# EAGLE design CurrentSensorV2.0 (EAGLE 6.5.0)
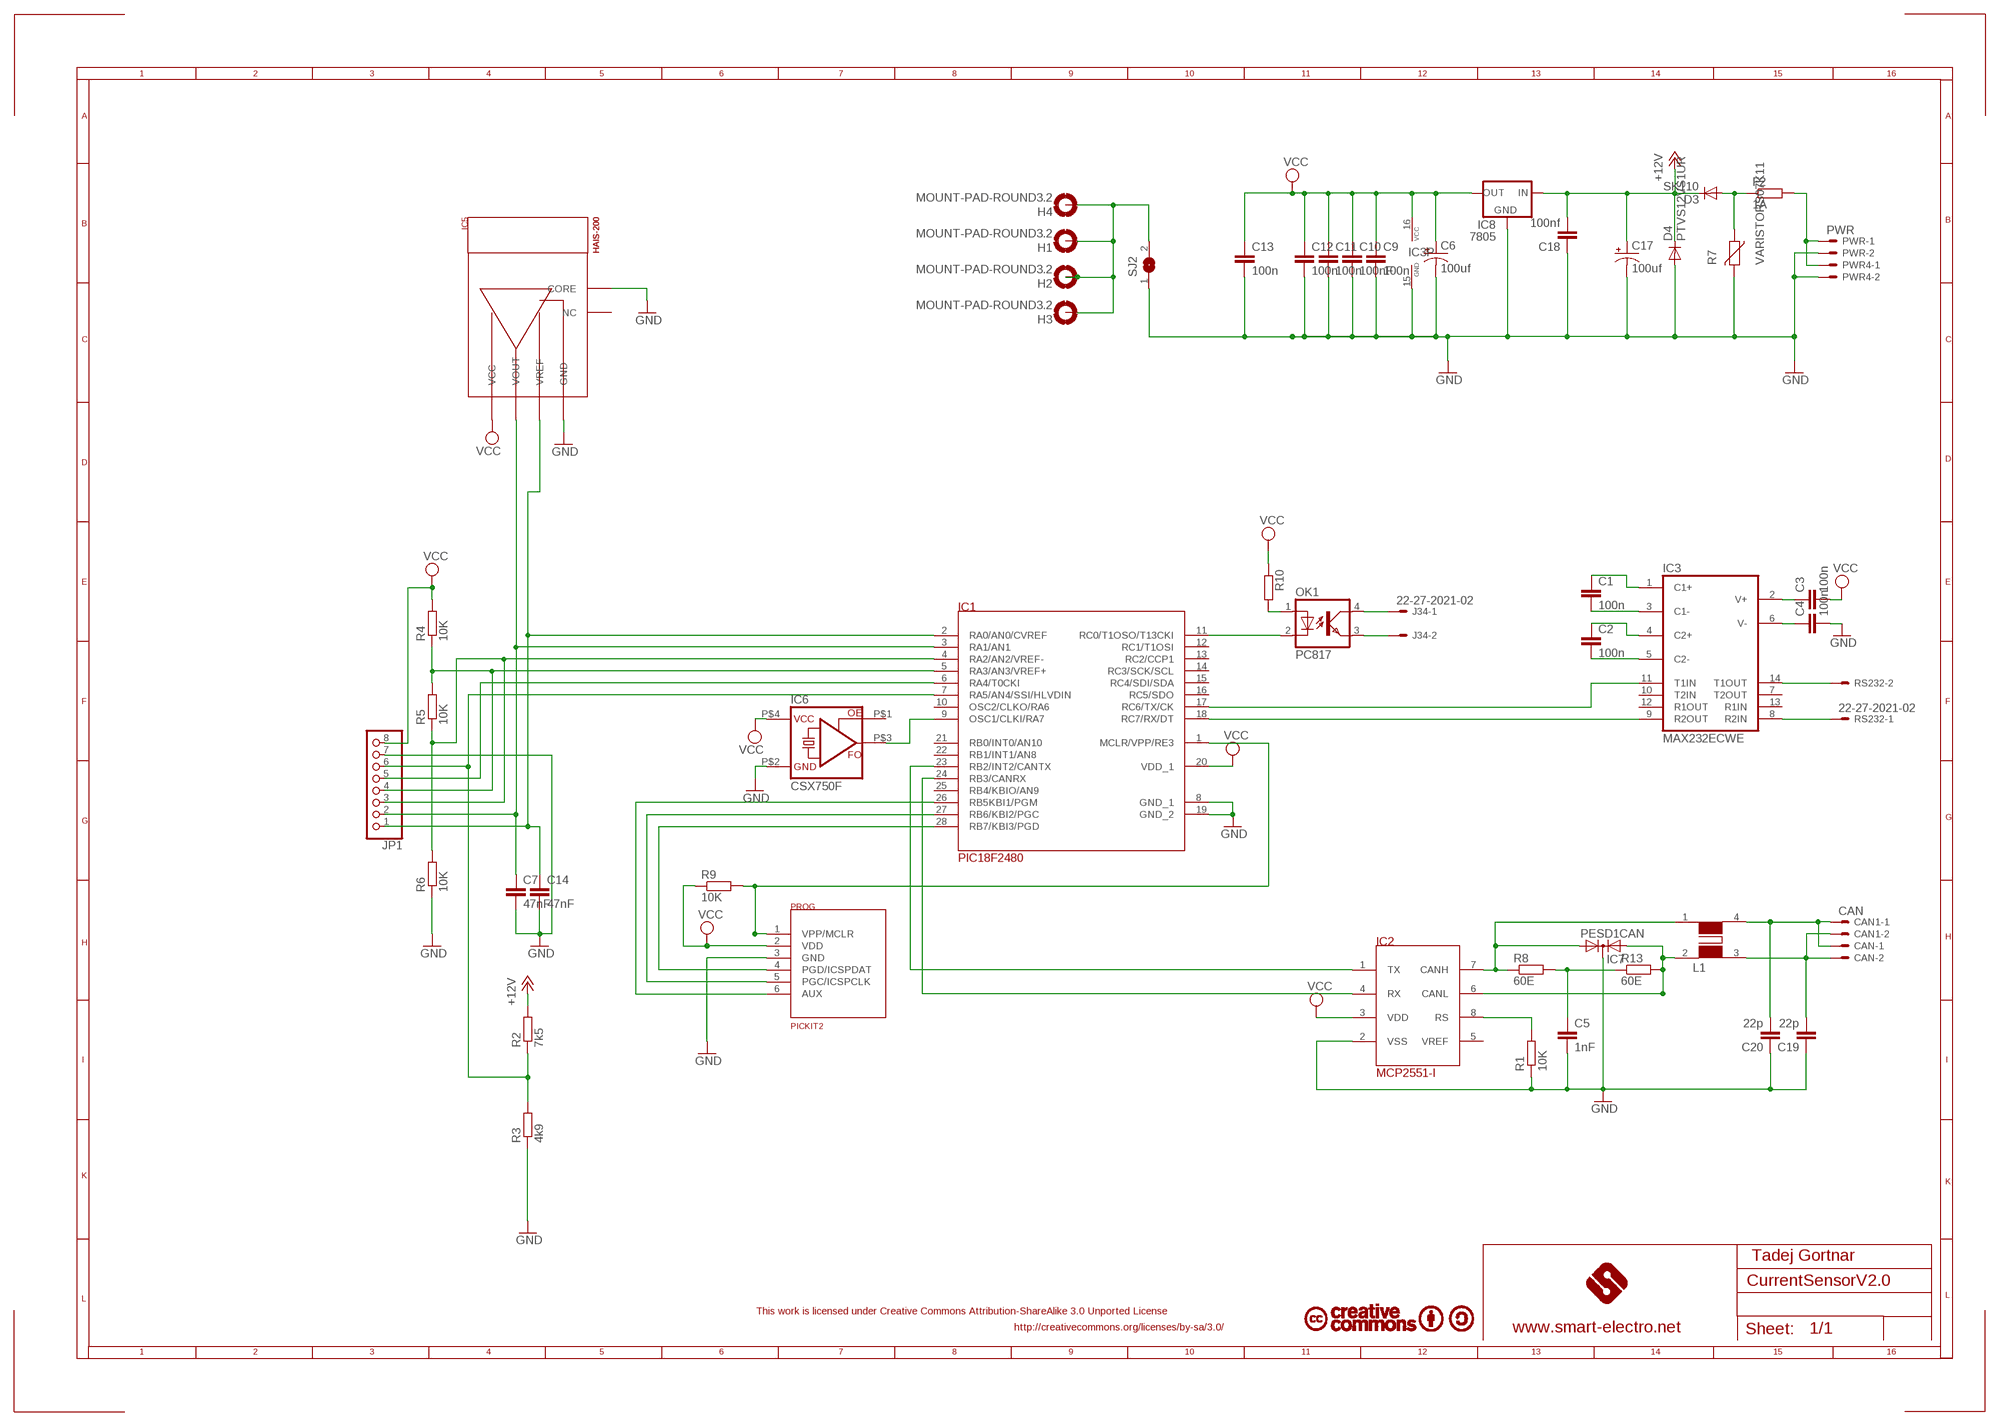
[diagram p0: schematic, sheet 1]

## Parts
C1  100n  C-EUC0805K  [C0805K]
C2  100n  C-EUC0805K  [C0805K]
C3  100n  C-EUC0805K  [C0805K]
C4  100n  C-EUC0805K  [C0805K]
C5  1nF  C-EUC0805  [C0805]
C6  100uf  CPOL-USC  [PANASONIC_C]
C7  47nF  C-EUC0805K  [C0805K]
C9  100n  C-EUC0805K  [C0805K]
C10  100nF  C-EUC0805K  [C0805K]
C11  100n  C-EUC0805K  [C0805K]
C12  100n  C-EUC0805K  [C0805K]
C13  100n  C-EUC0805K  [C0805K]
C14  47nF  C-EUC0805K  [C0805K]
C17  100uf  CPOL-USC  [PANASONIC_C]
C18  100nf  C-EUC0805  [C0805]
C19  22p  C-EUC0805  [C0805]
C20  22p  C-EUC0805  [C0805]
CAN  CAN  22-27-2021-02  [6410-02]
CAN1  CAN  22-27-2021-02  [6410-02]
D3  SK110  DIODE-MINIMELF  [MINIMELF]
D4  PTVS12VS1UR  DIODE-SOD323-W  [SOD323-W]
F2  1A  R-EU_R1206  [R1206]
H1  MOUNT-PAD-ROUND3.2  [3,2-PAD]
H2  MOUNT-PAD-ROUND3.2  [3,2-PAD]
H3  MOUNT-PAD-ROUND3.2  [3,2-PAD]
H4  MOUNT-PAD-ROUND3.2  [3,2-PAD]
IC1  PIC18F2480  PIC18F280  [SO-28W]
IC2  MCP2551-I  MCP2551  [SO-08]
IC3  MAX232ECWE  [SO16L]
IC5  HAIS-200  [HAIS-P]
IC6  CSX750F  [CSX750]
IC7  PESD1CAN  BAS70-06  [SOT23]
IC8  7805  78XXS'SOT223'  [SOT223]
J34  22-27-2021-02  [6410-02]
JP1  PINHD-1X8  [1X08]
L1  WE-DD_M/S  [WE-DD_M/S]
OK1  PC817  [DIL04]
PROG  PICKIT2  [PINHD-1X6]
PWR  PWR  22-27-2021-02  [6410-02]
PWR4  PWR  22-27-2021-02  [6410-02]
R1  10K  R-EU_M0805  [M0805]
R2  7k5  R-EU_M0805  [M0805]
R3  4k9  R-EU_M0805  [M0805]
R4  10K  R-EU_M0805  [M0805]
R5  10K  R-EU_M0805  [M0805]
R6  10K  R-EU_M0805  [M0805]
R7  VARISTORS07K11  [S07K11]
R8  60E  R-EU_R0805  [R0805]
R9  10K  R-EU_M0805  [M0805]
R10  R-EU_M0805  [M0805]
R13  60E  R-EU_R0805  [R0805]
RS232  22-27-2021-02  [6410-02]
SJ2  SJ  [SJ]

## Nets
+12V: C17.+ C18.2 D3.C D4.C IC8.1(IN) R2.2
AGND: H1.B3,2(MOUNT) H2.B3,2(MOUNT) H3.B3,2(MOUNT) H4.B3,2(MOUNT) SJ2.2
GND: C4.2 C5.2 C6.- C7.2 C9.2 C10.2 C11.2 C12.2 C13.2 C14.2 C17.- C18.1 C19.1 C20.1 D4.A IC1.8(GND_1) IC1.19(GND_2) IC2.2(VSS) IC3.15(GND) IC5.P$2(GND) IC5.P$5(CORE) IC6.P$2(GND) IC7.3(C) IC8.2(GND) JP1.7 PROG.3(GND) PWR4.2 PWR.2 R1.1 R3.1 R6.1 R7.2 SJ2.1
N$1: IC1.1(MCLR/VPP/RE3) PROG.1(VPP/MCLR) R9.2
N$2: IC1.24(RB3/CANRX) IC2.4(RX)
N$3: IC2.7(CANH) IC7.1(A1) L1.1 R8.1
N$4: IC1.23(RB2/INT2/CANTX) IC2.1(TX)
N$5: C7.1 IC1.3(RA1/AN1) IC5.P$3(VOUT) JP1.2
N$6: C14.1 IC1.2(RA0/AN0/CVREF) IC5.P$4(VREF) JP1.1
N$8: IC1.9(OSC1/CLKI/RA7) IC6.P$3(FO)
N$9: IC1.28(RB7/KBI3/PGD) PROG.4(PGD/ICSPDAT)
N$10: IC1.27(RB6/KBI2/PGC) PROG.5(PGC/ICSPCLK)
N$11: IC1.26(RB5KBI1/PGM) PROG.6(AUX)
N$14: IC1.17(RC6/TX/CK) IC3.11(T1IN)
N$15: IC1.18(RC7/RX/DT) IC3.9(R2OUT)
N$16: IC3.8(R2IN) RS232.1
N$17: IC3.14(T1OUT) RS232.2
N$18: C3.1 IC3.2(V+)
N$19: C4.1 IC3.6(V-)
N$21: C1.1 IC3.1(C1+)
N$22: C1.2 IC3.3(C1-)
N$24: IC1.11(RC0/T1OSO/T13CKI) OK1.2(C)
N$25: C5.1 R8.2 R13.1
N$26: C2.1 IC3.4(C2+)
N$27: C2.2 IC3.5(C2-)
N$28: IC1.4(RA2/AN2/VREF-) JP1.3 R5.1 R6.2
N$29: IC1.5(RA3/AN3/VREF+) JP1.4 R4.1 R5.2
N$30: IC1.6(RA4/T0CKI) JP1.5
N$31: IC1.7(RA5/AN4/SSI/HLVDIN) JP1.6 R2.1 R3.2
N$32: OK1.1(A) R10.2
N$33: J34.2 OK1.3(EMIT)
N$34: J34.1 OK1.4(COL)
N$73: IC2.8(RS) R1.2
N$82: IC2.6(CANL) IC7.2(A2) L1.2 R13.2
N$85: F2.2 PWR4.1 PWR.1
N$86: D3.A F2.1 R7.1
N$88: C20.2 CAN1.1 CAN.1 L1.4
N$89: C19.2 CAN1.2 CAN.2 L1.3
VCC: C3.2 C6.+ C9.1 C10.1 C11.1 C12.1 C13.1 IC1.20(VDD_1) IC2.3(VDD) IC3.16(VCC) IC5.P$1(VCC) IC6.P$4(VCC) IC8.3(OUT) JP1.8 PROG.2(VDD) R4.2 R9.1 R10.1
Unconnected: IC1.10(OSC2/CLKO/RA6) IC1.12(RC1/T1OSI) IC1.13(RC2/CCP1) IC1.14(RC3/SCK/SCL) IC1.15(RC4/SDI/SDA) IC1.16(RC5/SDO) IC1.21(RB0/INT0/AN10) IC1.22(RB1/INT1/AN8) IC1.25(RB4/KBIO/AN9) IC2.5(VREF) IC3.7(T2OUT) IC3.10(T2IN) IC3.12(R1OUT) IC3.13(R1IN) IC5.P$6(NC) IC6.P$1(OE)

## Notes on the sheet
- Tadej Gortnar
- This work is licensed under Creative Commons Attribution-ShareAlike 3.0 Unported License
- http://creativecommons.org/licenses/by-sa/3.0/ | www.smart-electro.net

## Library data of the parts
C1-C5 C7 C9-C14 C19 C20 = rcl:C-EU: CAPACITOR, European symbol
C6 C17 = resistor:CPOL-US: POLARIZED CAPACITOR, American symbol
C18 = resistor:C-EU: CAPACITOR, European symbol
CAN CAN1 J34 PWR PWR4 RS232 = con-molex:22-?-02: CONNECTOR wire to board 2.54 mm (.1 inch) pitch header; OC_FARNELL: unknown; OC_NEWARK: unknown
D3 D4 = diode:DIODE-: DIODE
F2 = resistor:R-EU_: RESISTOR, European symbol
H1-H4 = holes:MOUNT-PAD-ROUND: MOUNTING PAD, round
IC1 = microchip-5:PIC18F2*80: PIC18F2480 Enhenced Flash Microcontroler with ECAN
IC2 = microchip-5:MCP2551: High Speed CAN Transceiver
IC3 = maxim:MAX232ECWE: RS232 TRANSEIVER
IC5 = lem:HAIS-200: Current Transducer
IC6 = crystal:CSX750F: CRYSTAL RESONATOR
IC7 = diode:BAS70-06: Silicon Schottky Diodes General-purpose diode for high-speed switching
IC8 = v-reg:78XXS: VOLTAGE REGULATOR
JP1 = pinhead_old:PINHD-1X8
L1 = wuerth-elektronik:WE-DD: SMD-Shielded Power Transformers (SEPIC) WE_DD WE-DD with two identical windings is perfect for SEPIC- switching regulators - 1:1 transformer - Double inductor with two identical windings -- SEPIC-switching regulators
OK1 = optocoupler:PC817: SHARP OPTO COUPLER
PROG = microchip-5:PICKIT2: PIC Kit 2 - Programer
R1-R6 R8-R10 R13 = rcl:R-EU_: RESISTOR, European symbol
R7 = varistor:VARISTOR: VARISTOR
SJ2 = jumper:SJ: SMD solder JUMPER

## Net classes
1 balancing current: width 1.524 mm

## Board
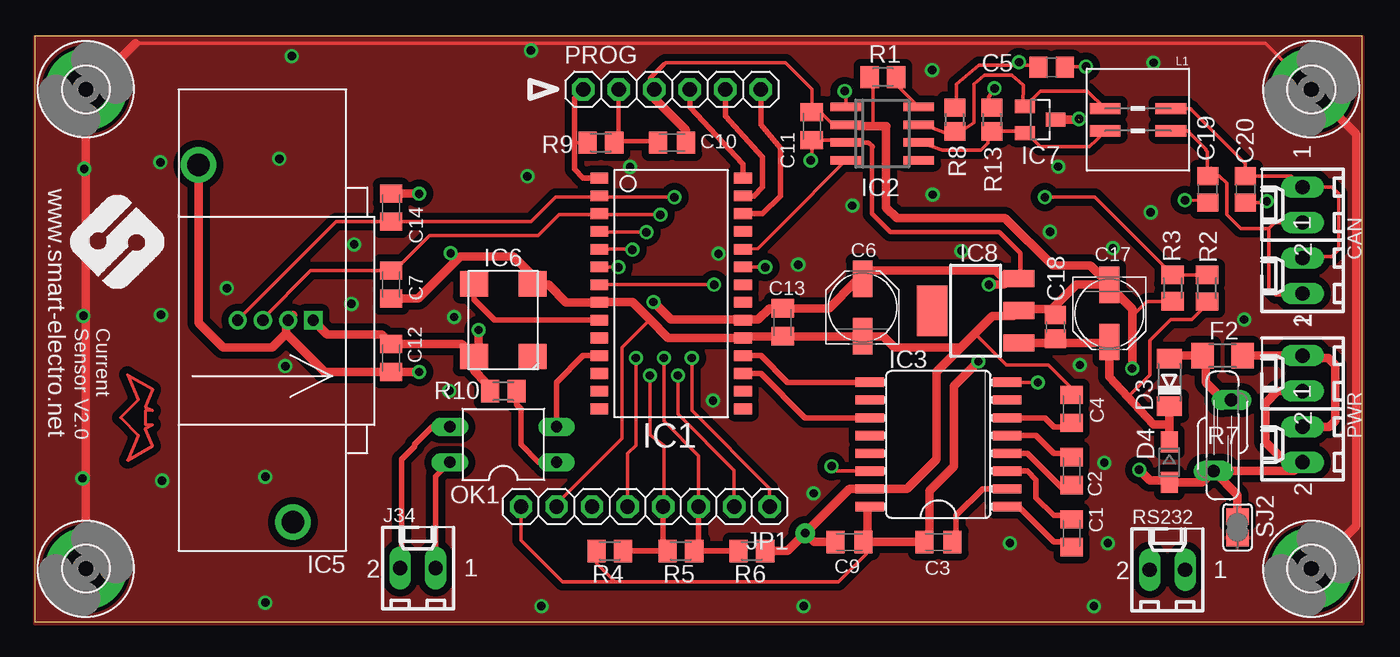
[diagram p1: board, top side]
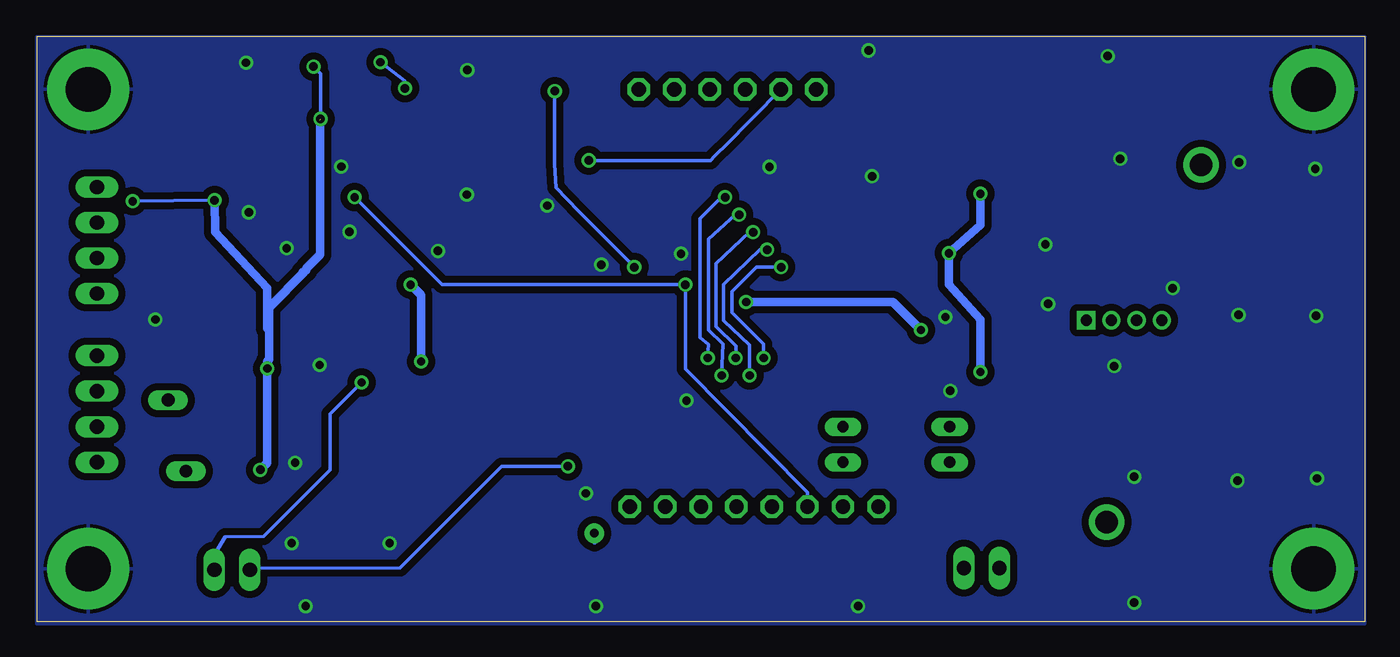
[diagram p2: board, bottom side, seen from below]

Size 94.92 x 41.9 mm. Coordinates in mm from the lower left corner, seen from the top.
Outline: 0,0 94.92,0 94.92,41.9 0,41.9 0,0
Copper layers (1*16): Top 0.035mm / dielectric 1.5mm / Bottom 0.035mm
Design rules "default2 *": minimum track width 10mil, minimum drill 0.6mm, track to track 8mil, track to pad 8mil, pad to pad 8mil, via to via 8mil, smd to smd 8mil, copper to edge 0mil, drill to drill 8mil, minimum pad ring 10mil, minimum via ring 8mil, stop-mask expansion 4mil, vias tented up to drill 0mil, thermal gap 10mil

### Footprints (pad centres in the part's own frame; a part is rotated, then mirrored left to right if it is on the bottom)
C0805K = smd 1.3 x 1.6: 1 -1,0; 2 1,0
C0805 = smd 1.3 x 1.5: 1 -0.95,0; 2 0.95,0
PANASONIC_C = smd 2.6 x 1.4: + 2.05,0; - -2.05,0
C0805' = smd 1.3 x 1.5: 1 -0.85,0; 2 0.85,0
6410-02 = drill 1.016 long: 1 1.27,0; 2 -1.27,0
MINIMELF = smd 1.4 x 1.8: A 1.7,0; C -1.7,0
SOD323-W = smd 1.5 x 1.2: A 1.45,0; C -1.45,0
R1206 = smd 1.6 x 1.803: 1 -1.422,0; 2 1.422,0
3,2-PAD = drill 3.2 pad 5.842: B3,2 0,0
SO-28W = smd 0.762 x 1.27: 1 -7.62,-5.207; 2 -6.35,-5.207; 3 -5.08,-5.207; 4 -3.81,-5.207; 5 -2.54,-5.207; 6 -1.27,-5.207; 7 0,-5.207; 8 1.27,-5.207; 9 2.54,-5.207; 10 3.81,-5.207; 11 5.08,-5.207; 12 6.35,-5.207; 13 7.62,-5.207; 14 8.89,-5.207; 15 8.89,5.08; 16 7.62,5.08; 17 6.35,5.08; 18 5.08,5.08; 19 3.81,5.08; 20 2.54,5.08; 21 1.27,5.08; 22 0,5.08; 23 -1.27,5.08; 24 -2.54,5.08; 25 -3.81,5.08; 26 -5.08,5.08; 27 -6.35,5.08; 28 -7.62,5.08
SO-08 = smd 0.6 x 2.2: 1 -1.905,-2.6; 2 -0.635,-2.6; 3 0.635,-2.6; 4 1.905,-2.6; 5 1.905,2.6; 6 0.635,2.6; 7 -0.635,2.6; 8 -1.905,2.6
SO16L = smd 0.66 x 2.032: 1 -4.445,-4.902; 2 -3.175,-4.902; 3 -1.905,-4.902; 4 -0.635,-4.902; 5 0.635,-4.902; 6 1.905,-4.902; 7 3.175,-4.902; 8 4.445,-4.902; 9 4.445,4.902; 10 3.175,4.902; 11 1.905,4.902; 12 0.635,4.902; 13 -0.635,4.902; 14 -1.905,4.902; 15 -3.175,4.902; 16 -4.445,4.902
HAIS-P = drill 0.8 square: P$1 0,8.636 | drill 0.8: P$2 0,6.836; P$3 0,5.036; P$4 0,3.236 | drill 1.6 pad 2.54: P$5 -11.098,0.436; P$6 14.456,7.19
CSX750 = smd 1.8 x 2: P$1 -2.6,-2.1; P$2 2.6,-2.1; P$3 2.6,2.1; P$4 -2.6,2.1
SOT23 = smd 1 x 1.4: 1 -0.95,-1.1; 2 0.95,-1.1; 3 0,1.1
SOT223 = smd 1.219 x 2.235: 1 -2.311,-3.099; 2 0,-3.099; 3 2.311,-3.099 | smd 3.6 x 2.2: 4 0,3.099
1X08 = drill 1.016 pad 1.6 octagon: 1 -8.89,0; 2 -6.35,0; 3 -3.81,0; 4 -1.27,0; 5 1.27,0; 6 3.81,0; 7 6.35,0; 8 8.89,0
WE-DD_M/S = smd 0.8 x 2.2: 1 -0.8,-2.35; 2 0.8,-2.35; 3 0.8,2.35; 4 -0.8,2.35
DIL04 = drill 0.813 long: 1 -1.27,-3.81; 2 1.27,-3.81; 3 1.27,3.81; 4 -1.27,3.81
PINHD-1X6 = drill 1.016 pad 1.6 octagon: 1 -6.35,0; 2 -3.81,0; 3 -1.27,0; 4 1.27,0; 5 3.81,0; 6 6.35,0
M0805 = smd 1.3 x 1.6: 1 -0.95,0; 2 0.95,0
S07K11 = drill 0.914 long: 1 -0.635,-2.54; 2 0.635,2.54
R0805 = smd 1.3 x 1.5: 1 -0.85,0; 2 0.85,0
SJ = smd 1.168 x 1.6: 1 -0.762,0; 2 0.762,0

### Placement (x,y rotation side)
C1  74.13,6.34 90 top
C2  74.13,10.79 90 top
C3  64.61,5.71 180 top
C4  74.13,15.24 90 top
C5  72.7,39.68 0 top
C6  59.18,22.49 90 top
C7  25.47,24.13 270 top
C9  58.25,5.71 180 top
C10  45.55,34.29 0 top
C11  55.56,35.47 90 top
C12  25.47,18.88 270 top
C13  53.46,21.43 270 top
C14  25.47,29.63 90 top
C17  76.83,22.07 270 top
C18  100nf  [C0805']  72.97,21.1 270 top
C19  83.86,30.95 90 top
C20  86.56,30.95 90 top
CAN  90.64,29.84 90 top
CAN1  90.64,24.76 90 top
D3  81.11,17.14 90 top
D4  81.11,11.43 270 top
F2  84.92,19.04 0 top
H1  3.64,3.8 0 top
H2  91.28,3.8 0 top
H3  91.28,38.1 0 top
H4  3.64,38.1 0 top
IC1  45.55,24.12 270 top
IC2  60.6,34.93 270 top
IC3  64.61,12.7 90 top
IC5  11.27,21.58 270 top
IC6  33.49,21.58 90 top
IC7  71.89,35.93 270 top
IC8  67.27,22.26 90 top
J34  27.39,3.84 0 top
JP1  43.65,8.25 180 top
L1  78.88,35.93 270 top
OK1  33.49,12.7 90 top
PROG  45.55,38.1 0 top
PWR  90.64,12.7 90 top
PWR4  90.64,17.77 90 top
R1  60.64,38.97 0 top
R2  83.81,23.88 270 top
R3  81.34,23.88 90 top
R4  41.11,5.08 180 top
R5  46.19,5.08 180 top
R6  51.27,5.08 180 top
R7  84.92,13.33 180 top
R8  65.78,35.94 90 top
R9  40.48,34.29 180 top
R10  33.49,16.5 0 top
R13  68.43,35.94 270 top
RS232  80.98,3.73 0 top
SJ2  86,6.77 270 top

### Tracks (layer width: path | path; a pad name or v marks a point on that pad's centre or on a via)
+12V
  Top 0.254: R2.2 83.81,22.72 82.72,21.63 81.22,21.63 79.72,20.13 79.72,17.65 78.16,16.09
  Top 0.61: D3.C 81.11,14.13 | 81.11,14.13 D4.C | IC8.1 72.97,19.95 | 72.97,19.95 75.76,19.95 C17.+ 76.83,17.52 78.16,16.09 79.97,14.13 81.11,14.13 | C18.2 72.97,19.95
AGND  (via drill 0.6)
  Top 0.254: 7.22,41.38 87.99,41.38 H3.B3,2
  Top 0.61: H2.B3,2 91.39,3.8 94.47,6.88 94.47,34.9 H3.B3,2 | H1.B3,2 H4.B3,2 3.93,38.1 7.22,41.38
  other vias: 35.47,40.88 13.72,23.88 64.16,39.48 64.2,30.57 73.17,32.57 79.79,29.3 86.47,21.63 74.72,18.38 76.47,11.38 76.72,5.63 69.72,5.63 75.72,1.13 54.97,1.13 36.22,1.13 16.47,1.38 16.47,10.38 17.47,33.13 18.37,40.47 8.97,32.88 9.09,10.11 3.4,10.26 3.46,21.89 3.52,32.41 9.01,21.97 35.22,31.88 79.99,40.01 17.9,18.29 29.62,16.54 22.82,27.01 22.63,22.75 29.97,21.81 42.55,32.55 48.88,26.34 55.68,9.19 48.49,15.83 54.58,25.56 66.26,26.54 58.45,29.78 72.59,27.9 77.08,26.73
  pour Top (isolate 0.5): 0.22,41.88 94.97,41.88 94.97,-0.12 -0.03,-0.12 -0.03,41.88
  pour Bottom (isolate 0.5): 0.22,41.88 94.97,41.88 94.97,-0.12 -0.03,-0.12 -0.03,41.88
GND  (via drill 0.6, 0.6 pad 1.42)  (1 unrouted)
  Top 0.254: v75.16,39.73 73.7,39.73 C5.2 | C20.1 87.6,30 87.72,29.88 v88.09,30.09 | v82.24,30.17 83.72,30.13 C19.1 | 50.75,20.43 IC1.19 | 56.91,35.73 56.17,36.47 C11.2 55.56,38.13 53.68,40.01 45.1,40.01 44.99,39.9 | 56.91,35.73 57.83,35.73 IC2.2 59.49,35.56 | 59.49,35.56 59.91,35.48 59.91,38.4 R1.1 | R3.1 79.53,22.93 78.47,21.88 | 56.91,35.73 57.16,35.48 58.91,35.48 59.41,35.48 59.49,35.56 | JP1.7 37.3,8.46 41.97,13.13 41.97,19.63 43.97,21.63 | C4.2 74.13,16.72 72.47,18.38 69.47,18.38 67.22,20.63
  Top 0.305: 46.55,35.19 46.55,35.3 43.97,37.88 43.97,38.88 44.99,39.9 | 59.85,39.01 R1.1
  Top 0.61: C10.2 46.55,35.19 44.28,37.46 PROG.3 | R6.1 53.81,5.08 v55.08,6.34 | v55.08,6.34 58.25,9.52 IC3.15 62.36,9.52 64.47,11.63 64.47,17.88 66.22,19.63 | v55.08,6.34 55.71,5.71 C9.2 | C6.- C13.2 50.75,20.43 | C6.- | C6.- 60.67,20.43 61.47,19.63 66.22,19.63 | 66.22,19.63 67.22,20.63 68.47,21.88 69.98,21.88 IC8.2 70.48,22.38 72.72,22.38 | R7.2 83.47,9.98 D4.A 80.96,10.13 79.72,10.13 v78.97,10.88 78.87,10.78 | R7.2 90,10.79 PWR.2 90.44,11.63 89.22,11.63 87.97,12.88 87.97,15.63 88.84,16.5 PWR4.2 | C17.- 74.46,24.12 72.72,22.38 | C17.- 76.73,24.12 78.47,22.38 78.47,21.88 v78.47,18.13 | C18.1 72.97,22.13 72.72,22.38 | IC1.19 45.28,20.31 43.97,21.63 42.72,22.88 40.37,22.88 IC1.8 37.99,22.86 36.72,24.13 35.64,24.13 IC6.P$2 35.59,24.76 34.22,26.13 30.41,26.13 30.19,25.91 | 18.47,21.95 IC5.P$2 17.97,21.45 17.97,20.63 | 58.91,35.48 59.91,35.48 60.91,35.48 60.87,35.44 60.87,29.65 61.64,28.88 69.38,28.88 72.78,25.47 75.47,25.47 C17.- | IC5.P$5 11.7,21.4 13.47,19.63 16.97,19.63 17.97,20.63 | 17.97,20.63 20.72,17.88 C12.2 v27.47,17.88 | C7.2 27.41,23.13 30.19,25.91 | C14.2 v27.47,30.63 | v29.72,26.38 30.19,25.91 | SJ2.1 86,9.08 R7.2 | IC7.3 74.6,35.93 v74.66,35.98
  Bottom 0.254: v75.16,39.73 74.66,39.23 v74.66,35.98 | v88.09,30.09 v82.24,30.17
  Bottom 0.406: v55.08,6.34 55.08,5.71
  Bottom 0.61: v78.97,10.88 78.47,11.38 v78.47,18.13 78.47,18.63 78.34,18.75 78.34,20.88 | 75.82,25.03 78.34,22.5 78.34,20.88 | v82.24,30.17 82.2,27.88 78.47,23.88 78.47,21 78.34,20.88 | v27.47,30.63 27.47,28.38 v29.72,26.38 29.72,24.13 27.47,21.63 v27.47,17.88 | 75.92,25.03 75.82,25.03 | 75.82,25.03 75.7,25.15 75.7,25.29 74.69,26.3 74.69,35.91
N$1
  Top 0.254: R9.2 38.73,34.29 38.57,34.13 | PROG.1 38.57,37.46
  Top 0.406: IC1.1 39.2,31.74 38.57,32.38 38.57,34.13 38.57,37.46
N$2
  Top 0.254: IC1.24 51.7,26.7 55.16,30.17 56.22,31.24 IC2.4
N$3
  Top 0.254: L1.1 75.27,37.98 71.91,37.98 70.8,36.88 IC7.1 70.66,37.01 70.7,38.4 69.84,39.1 67.89,39.1 67.16,38.48 67.16,35.73 66.27,35.09 R8.1 65.67,34.98 65.16,34.98 63.58,35.56 IC2.7
N$4  (via drill 0.6)
  Top 0.254: IC2.1 58,37.89 v57.91,37.98 | v52.22,25.38 50.65,25.38 IC1.23
  Bottom 0.254: v57.91,37.98 57.91,32.73 57.82,31.08 56.22,29.38 v52.22,25.38
N$5  (via drill 0.6)
  Top 0.254: JP1.2 50,10.85 45.97,14.88 v45.97,17.63 | v44.72,29.13 40.42,29.13 IC1.3 40.27,29.13 37.47,29.13 35.97,27.63 28.22,27.63 25.72,25.13 C7.1 19.72,25.13 16.3,21.71 IC5.P$3
  Bottom 0.254: v45.97,17.63 45.89,19.9 46.91,20.88 46.91,27.38 44.97,29.13 v44.72,29.13
N$6  (via drill 0.6)
  Top 0.254: JP1.1 52.54,9.56 46.97,15.13 v46.97,18.88 | v45.72,30.38 40.44,30.38 IC1.2 40.25,30.38 37.22,30.38 35.47,28.63 C14.1 21.55,28.63 IC5.P$4
  Bottom 0.254: v46.97,18.88 46.93,19.83 47.53,20.36 47.53,28.86 45.97,30.38 v45.72,30.38
N$8
  Top 0.406: IC6.P$3 31.39,23.05 32.85,21.58 IC1.9
N$9
  Top 0.406: IC1.28 50.63,32.77 46.82,36.83 PROG.4
N$10
  Top 0.406: IC1.27 51.41,30.47 52.04,31.11 52.04,33.27 49.37,36.19 PROG.5
N$11
  Top 0.406: IC1.26 52.04,29.2 53.31,30.47 53.31,33.9 51.91,35.55 PROG.6
N$14
  Top 0.406: IC1.17 51.91,17.77 55.08,14.6 IC3.11
N$15
  Top 0.406: IC1.18 51.91,19.04 53.81,17.14 IC3.9
N$16  (via drill 0.6)
  Top 0.254: v71.72,17.13 IC3.8
  Bottom 0.254: RS232.1 82.13,5 81.47,6.09 78.72,6.13 73.97,10.88 73.97,14.88 v71.72,17.13
N$17  (via drill 0.6)
  Top 0.254: IC3.14 57.31,10.79 v56.97,11.13
  Bottom 0.254: v56.97,11.13 61.72,11.13 68.97,3.88 79.56,3.84 RS232.2
N$18
  Top 0.254: C3.1 65.88,6.34
  Top 0.406: 65.88,6.34 65.88,7.62 67.78,9.52 IC3.2
N$19
  Top 0.254: 73.5,13.97 C4.1
  Top 0.406: IC3.6 72.22,14.6 72.86,13.97 73.5,13.97
N$21
  Top 0.254: C1.1 73.5,5.71 | 70.32,8.25 IC3.1
  Top 0.406: 73.5,5.71 72.86,5.71 70.32,8.25
N$22
  Top 0.254: 73.5,7.62 C1.2
  Top 0.406: 73.5,7.62 72.86,7.62 71.59,8.89 71.59,10.16 70.95,10.79 IC3.3
N$24
  Top 0.406: IC1.11 39.2,19.04 37.3,17.14 OK1.2
N$25  (via drill 0.6)
  Top 0.254: C5.1 71.55,39.83 | 71.55,39.83 67.49,39.83 65.91,38.48 65.91,36.92 R8.2 | R13.1 68.18,37.5 v68.62,38.18 | v70.37,40.04 70.5,39.84 71.55,39.83
  Bottom 0.254: v68.62,38.18 68.66,38.73 v70.37,40.04
N$26
  Top 0.254: 73.5,9.52 C2.1
  Top 0.406: IC3.4 70.95,12.06 73.5,9.52
N$27
  Top 0.356: 73.5,12.06 C2.2
  Top 0.406: IC3.5 71.59,13.33 72.86,12.06 73.5,12.06
N$28  (via drill 0.6)
  Top 0.254: JP1.3 47.46,11.89 44.97,14.38 v44.97,18.88 | v43.72,27.88 40.4,27.88 IC1.4
  Top 0.406: 50.63,5.08 R6.2 47.46,5.08 | R5.1 47.46,5.08 | 47.46,5.08 JP1.3
  Bottom 0.254: v44.97,18.88 44.93,19.72 46.38,21.13 46.38,25.63 43.97,27.88 v43.72,27.88
N$29  (via drill 0.6)
  Top 0.254: IC1.5 42.19,26.66 v42.72,26.63 | v43.97,17.63 43.97,13.38 44.97,12.63 44.97,8.3 JP1.4
  Top 0.406: R4.1 44.92,5.08 | 44.92,5.08 R5.2 | 44.92,5.08 JP1.4
  Bottom 0.254: v43.97,17.63 43.97,19.82 45.84,21.57 45.84,24.13 43.22,26.63 v42.72,26.63
N$30  (via drill 0.6)
  Top 0.254: JP1.5 42.38,12.04 42.97,12.63 v42.97,18.88 | v41.72,25.38 40.61,25.38 IC1.6
  Bottom 0.254: v42.97,18.88 42.97,19.88 45.22,22.13 45.22,23.63 43.47,25.38 v41.72,25.38
N$31  (via drill 0.6)
  Top 0.254: R2.1 R3.2 | R3.2 81.42,24.83 | 81.42,24.83 81.47,24.88 | 81.42,24.83 81.22,24.63 | IC1.7 48.21,24.12 v48.57,24.13 | v72.22,30.38 75.8,30.38 R3.2
  Bottom 0.254: v72.22,30.38 65.97,24.13 v48.57,24.13 48.57,18.1 39.84,9.25 JP1.6
N$32
  Top 0.406: R10.2 34.44,15.56 34.76,15.24 34.76,12.7 36.03,11.43 OK1.1
N$33
  Top 0.406: OK1.3 28.41,13.97 27.14,12.7 27.14,12.55 26.22,11.63 26.22,3.94 J34.2
N$34
  Top 0.406: J34.1 28.66,10.41 OK1.4
N$35
  Top 0.203: 8.4,15.12 7.89,15.12 7.89,14.11 8.4,14.11 7.89,13.86 8.4,12.59 6.62,11.57 7.39,13.35 6.12,14.62 7.39,15.89 6.62,17.66 8.4,16.65 7.89,15.38 8.4,15.12
N$73
  Top 0.254: R1.2 61.55,38.48 IC2.8
N$82
  Top 0.254: L1.2 76.41,35.01 75.91,34.48 75.41,33.98 71.91,33.98 70.91,34.98 IC7.2 70.68,35.09 R13.2 68.16,34.82 68.16,34.23 67.66,33.73 64.91,33.73 63.35,34.29 IC2.6
N$85
  Top 0.61: PWR.1 92.55,13.97 92.97,14.38 92.97,18.38 92.47,18.88 90.8,18.88 PWR4.1 F2.2
N$86
  Top 0.61: R7.1 84.98,15.87 83.72,17.13 83.72,18.83 F2.1 81.32,19.04 D3.A
N$88
  Top 0.254: CAN1.1 90.74,26.13 92.72,26.13 93.22,26.63 93.22,30.63 92.74,31.11 CAN.1 89.85,31.9 C20.2 86.56,32.79 82.66,36.69 82.66,36.73 L1.4
N$89
  Top 0.254: CAN.2 88.66,28.57 88.22,28.13 | 88.22,28.13 88.22,23.88 88.72,23.38 90.53,23.38 CAN1.2 | 83.58,31.63 C19.2 | C19.2 84.11,32.46 | L1.3 82.51,35.13 82.51,35.04 83.72,33.84 83.72,33.76 83.83,33.64 83.83,31.92 C19.2 | 83.72,32.04 C19.2 | C19.2 84.7,31.9 85.22,31.38 85.22,29.13 86.22,28.13 88.22,28.13
VCC  (via drill 0.6)
  Top 0.254: C3.2 63.97,6.34 | IC2.3 57.82,34.47 C11.1 55.56,33.1 v55.47,33.02 | R4.2 40.16,4.19 41.47,2.88 | 41.47,2.88 57.47,2.88 59.47,4.88 59.47,5.5 C9.1 | JP1.8 34.76,5.84 37.72,2.88 41.47,2.88
  Top 0.305: IC2.3 59.6,34.29 59.91,33.98 59.85,33.92 59.85,29.23 61.14,27.94 | IC8.3 70.47,24.68 70.47,26.38 68.97,27.88 61.2,27.88 61.18,27.9 | PROG.2 41.74,34.61 R9.1 41.62,34.29 41.72,34.38 44.46,34.38 C10.1 | 61.14,27.94 61.18,27.9 | 61.18,27.9 61.18,27.94 61.14,27.94
  Top 0.406: IC3.16 59.52,8.25 | 59.52,5.71 C9.1
  Top 0.61: 63.97,6.34 63.97,9.38 65.72,11.13 65.72,16.88 v67.47,18.63 | IC5.P$1 20.9,20.57 24.78,20.57 C12.1 30.49,19.88 IC6.P$4 | 59.52,8.25 59.52,5.71 C3.2 | IC8.3 69.72,24.57 | 69.72,24.57 69.28,24.57 68.72,25.13 59.77,25.13 C6.+ 59.02,24.38 58.72,24.38 56.77,22.43 C13.1 52.52,22.43 51.72,21.63 50.68,21.63 | 50.68,21.63 45.47,21.63 v44.22,22.88 | v31.72,20.88 31.72,19.31 IC6.P$4 | IC6.P$4 31.39,17.97 32.22,17.14 32.22,16.82 R10.1 | v68.22,24.13 69.28,24.13 69.72,24.57 | 50.68,21.63 IC1.20
  Bottom 0.254: PROG.2 45.79,34.01 46.21,33.59 46.47,33.33 46.79,33.02 v55.47,33.02
  Bottom 0.61: v44.22,22.88 33.72,22.88 v31.72,20.88 | v67.47,18.63 67.47,23.38 v68.22,24.13

### Text on the board
tNames: www.smart-electro.net | Current / Sensor V2.0